# EAGLE design untitled (EAGLE 5.08)
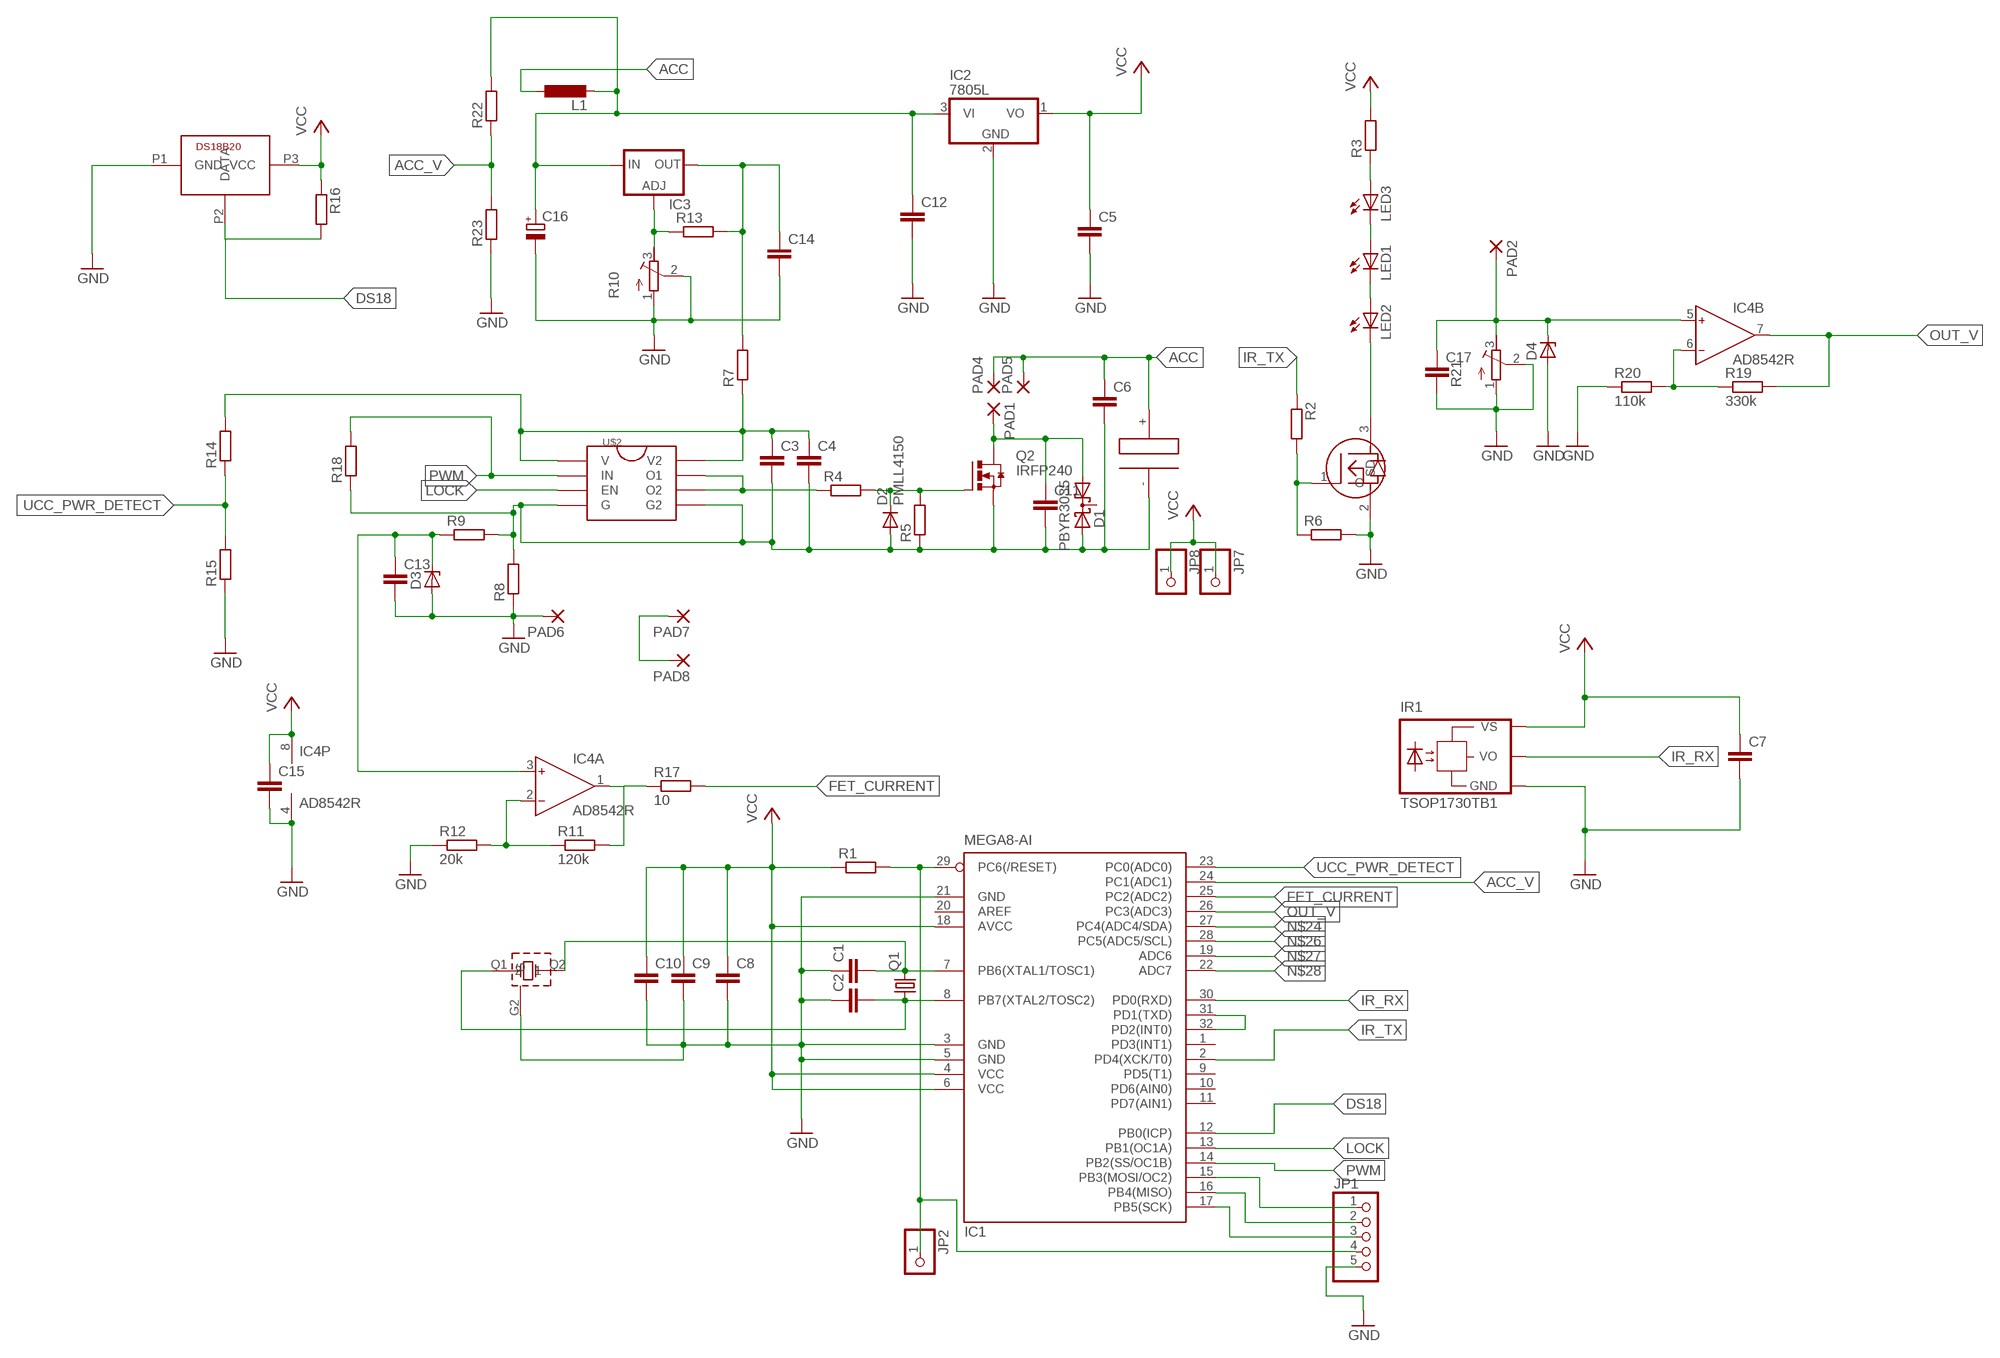
[diagram p0: schematic, sheet 1]

## Parts
C1  C-EUC0805  [C0805]
C2  C-EUC0805  [C0805]
C3  C-EUC1206  [C1206]
C4  C-EU075-032X103  [C075-032X103]
C5  C-EUC1206  [C1206]
C6  C22/10  [C22.5B10]
C7  C-EUC0805  [C0805]
C8  C-EUC0805  [C0805]
C9  C-EUC0805  [C0805]
C10  C-EUC0805  [C0805]
C11  C7.5/6  [C7.5B6]
C12  C-EUC1206  [C1206]
C13  C-EUC1206  [C1206]
C14  C-EUC1206  [C1206]
C15  C-EUC1206  [C1206]
C16  CPOL-EUE7.5-16  [E7,5-16]
C17  C-EUC0805  [C0805]
D1  PBYR3035  [SOT93S]
D2  PMLL4150  [SOD80C]
D3  ZENER-DIODEDO34-7  [DO34Z7]
D4  ZENER-DIODEDO34-7  [DO34Z7]
IC1  MEGA8-AI  [TQFP32-08]
IC2  7805L  [TO92]
IC3  LM317TS  [317TS]
IC4  AD8542R  [SO8]
IR1  TSOP1730TB1  [TSOP17_TB1]
JP1  PINHD-1X5  [1X05]
JP2  PINHD-1X1  [1X01]
JP7  PINHD-1X1  [1X01]
JP8  PINHD-1X1  [1X01]
L1  L-EUL2825P  [L2825P]
LED1  LED5MM  [LED5MM]
LED2  LED5MM  [LED5MM]
LED3  LED5MM  [LED5MM]
PAD1  3,81/1,3  [3,81/1,3]
PAD2  3,81/1,3  [3,81/1,3]
PAD4  3,81/1,3  [3,81/1,3]
PAD5  3,81/1,3  [3,81/1,3]
PAD6  WIREPAD4,16O1,6  [4,16O1,6]
PAD7  WIREPAD4,16O1,6  [4,16O1,6]
PAD8  WIREPAD4,16O1,6  [4,16O1,6]
Q1  CRYSTALHC49S  [HC49/S]
Q2  IRFP240  [TO247BV]
R1  R-EU_M0805  [M0805]
R2  R-EU_M0805  [M0805]
R3  R-EU_M0805  [M0805]
R4  R-EU_M1206  [M1206]
R5  R-EU_M1206  [M1206]
R6  R-EU_M0805  [M0805]
R7  R-EU_0207/12  [0207/12]
R8  R-EU_0309/12  [0309/12]
R9  R-EU_M1206  [M1206]
R10  R-TRIMM3296W  [RTRIM3296W]
R11  120k  R-EU_M1206  [M1206]
R12  20k  R-EU_M1206  [M1206]
R13  R-EU_M0805  [M0805]
R14  R-EU_M1206  [M1206]
R15  R-EU_M1206  [M1206]
R16  R-EU_M1206  [M1206]
R17  10  R-EU_M1206  [M1206]
R18  R-EU_M1206  [M1206]
R19  330k  R-EU_M1206  [M1206]
R20  110k  R-EU_M1206  [M1206]
R21  R-TRIMM3296P  [RTRIM3296P]
R22  R-EU_M1206  [M1206]
R23  R-EU_M1206  [M1206]
U$1  IRLML2803  [MICRO3]
U$2  UCC37322  [SO08]
U$3  KX-7  [KX-7]
U$4  CAP36MM13,6MM  [CAP36MM13.5MM]
U$5  DS18B20  [TO-92]

## Nets
ACC: C6.1 L1.1 PAD4.1(P) PAD5.1(P) U$4.+
ACC_L: C12.1 C16.+ IC2.3(VI) IC3.3(IN) L1.2 R22.2
ACC_V: IC1.24(PC1(ADC1)) R22.1 R23.2
DS18: IC1.12(PB0(ICP)) R16.2 U$5.P2(DATA)
FET_CURRENT: IC1.25(PC2(ADC2)) R17.2
FET_CURRENT0: IC4.1(A:OUT) R11.2 R17.1
GND: C1.1 C2.1 C5.2 C7.2 C8.2 C9.2 C10.2 C12.2 C13.2 C14.2 C15.2 C16.- C17.2 D3.A D4.A IC1.3(GND) IC1.5(GND) IC1.21(GND) IC2.2(GND) IC4.4(P:V-) IR1.GND JP1.5 PAD6.1(P) R6.2 R8.1 R10.1(E) R10.2(S) R12.1 R15.1 R20.1 R21.1(E) R21.2(S) R23.1 U$1.2(S) U$3.G2(G) U$5.P1(GND)
IR_RX: IC1.30(PD0(RXD)) IR1.VO
IR_TX: IC1.2(PD4(XCK/T0)) R2.1
LOCK: IC1.13(PB1(OC1A)) U$2.3(EN)
N$1: IC1.29(PC6(/RESET)) JP1.4 JP2.1 R1.2
N$2: IC1.17(PB5(SCK)) JP1.3
N$3: IC1.16(PB4(MISO)) JP1.2
N$4: IC1.15(PB3(MOSI/OC2)) JP1.1
N$5: C3.1 C4.1 R7.1 R14.2 U$2.1(V) U$2.8(V2)
N$6: C2.2 IC1.8(PB7(XTAL2/TOSC2)) Q1.1 U$3.Q1
N$7: C11.1 D1.A1 PAD1.1(P) Q2.D
N$8: R4.1 U$2.6(O2) U$2.7(O1)
N$9: R2.2 R6.1 U$1.1(G)
N$10: LED2.K(C) U$1.3(D)
N$11: C13.1 D3.C IC4.3(A:IN+) R9.1
N$12: C3.2 C4.2 C6.2 C11.2 D1.A2 D2.A Q2.S R5.1 R8.2 R9.2 R18.1 U$2.4(G) U$2.5(G2) U$4.-
N$13: LED1.A LED3.K(C)
N$14: IC1.31(PD1(TXD)) IC1.32(PD2(INT0))
N$15: D2.C Q2.G R4.2 R5.2
N$16: LED3.A R3.1
N$17: LED1.K(C) LED2.A
N$18: PAD7.1(P) PAD8.1(P)
N$19: C14.1 IC3.2(OUT) R7.2 R13.2
N$21: IC3.1(ADJ) R10.3(A) R13.1
N$22: IC4.2(A:IN-) R11.1 R12.2
N$23: IC4.6(B:IN-) R19.1 R20.2
N$24: IC1.27(PC4(ADC4/SDA))
N$25: C17.1 D4.C IC4.5(B:IN+) PAD2.1(P) R21.3(A)
N$26: IC1.28(PC5(ADC5/SCL))
N$27: IC1.19(ADC6)
N$28: IC1.22(ADC7)
N$29: C1.2 IC1.7(PB6(XTAL1/TOSC1)) Q1.2 U$3.Q2
OUT_V: IC1.26(PC3(ADC3)) IC4.7(B:OUT) R19.2
PWM: IC1.14(PB2(SS/OC1B)) R18.2 U$2.2(IN)
UCC_PWR_DETECT: IC1.23(PC0(ADC0)) R14.1 R15.2
VCC: C5.1 C7.1 C8.1 C9.1 C10.1 C15.1 IC1.4(VCC) IC1.6(VCC) IC1.18(AVCC) IC2.1(VO) IC4.8(P:V+) IR1.VS JP7.1 JP8.1 R1.1 R3.2 R16.1 U$5.P3(VCC)
Unconnected: D1.C IC1.1(PD3(INT1)) IC1.9(PD5(T1)) IC1.10(PD6(AIN0)) IC1.11(PD7(AIN1)) IC1.20(AREF)

## Library data of the parts
C1-C5 C7-C10 C12-C15 C17 = rcl:C-EU: CAPACITOR, European symbol
C6 C11 = capacitor-wima:C: CAPACITOR naming: grid - package width
C16 = rcl:CPOL-EU: POLARIZED CAPACITOR, European symbol
D1 = diode:PBYR3035: Dual DIODE common cathode
D2 = diode:PMLL4150: DIODE high speed
D3 D4 = diode:ZENER-DIODE: Z-Diode
IC1 = atmel:MEGA8: MICROCONTROLLER 8 Kbytes FLASH, 1 kbytes SRAM, 512 bytes EEPROM, USART, 6-channel 10 bit ADC, 2-channel 8 bit ADC Pin compatible with Atmega48, ATMega88, ATMega168 Source: avr.lbr
IC2 = linear:78*: Positive VOLTAGE REGULATOR Source: http://cache.national.com/ds/LM/LM78L05.pdf http://www.fairchildsemi.com/ds/LM/LM7805.pdf
IC3 = v-reg:LM317TS: VOLTAGE REGULATOR
IC4 = analog-devices:AD8542: General-Purpose CMOS Rail-to-Rail Amplifiers Source: http://www.analog.com/static/imported-files/data_sheets/AD8541_8542_8544.pdf
IR1 = telefunken:TSOP17*TB1: TSOP17..TB1 IR Receiver Modules for Remote Control Systems Source: http://www.vishay.com/docs/82042/82042.pdf
JP1 = pinhead:PINHD-1X5: PIN HEADER
JP2 JP7 JP8 = pinhead:PINHD-1X1: PIN HEADER
L1 = rcl:L-EU: INDUCTOR, European symbol
LED1-LED3 = led:LED: LED OSRAM: - CHIPLED LG R971, LG N971, LY N971, LG Q971, LY Q971, LO R971, LY R971 LH N974, LH R974 LS Q976, LO Q976, LY Q976 LO Q996 - Hyper CHIPLED LW Q18S LB Q993, LB Q99A, LB R99A - SideLED LS A670, LO A670, LY A670, LG A670, LP A670 LB A673, LV A673, LT A673, LW A673 LH A674 LY A675 LS A676, LA A676, LO A676, LY A676, LW A676 LS A679, LY A679, LG A679 - Hyper Micro SIDELED® LS Y876, LA Y876, LO Y876, LY Y876 LT Y87S - SmartLED LW L88C, LW L88S LB L89C, LB L89S, LG L890 LS L89K, LO L89K, LY L89K LS L896, LA L896, LO L896, LY L896 - TOPLED LS T670, LO T670, LY T670, LG T670, LP T670 LSG T670, LSP T670, LSY T670, LOP T670, LYG T670 LG T671, LOG T671, LSG T671 LB T673, LV T673, LT T673, LW T673 LH T674 LS T676, LA T676, LO T676, LY T676, LB T676, LH T676, LSB T676, LW T676 LB T67C, LV T67C, LT T67C, LS T67K, LO T67K, LY T67K, LW E67C LS E67B, LA E67B, LO E67B, LY E67B, LB E67C, LV E67C, LT E67C LW T67C LS T679, LY T679, LG T679 LS T770, LO T770, LY T770, LG T770, LP T770 LB T773, LV T773, LT T773, LW T773 LH T774 LS E675, LA E675, LY E675, LS T675 LS T776, LA T776, LO T776, LY T776, LB T776 LHGB T686 LT T68C, LB T68C - Hyper Mini TOPLED® LB M676 - Mini TOPLED Santana® LG M470 LS M47K, LO M47K, LY M47K Source: http://www.osram.convergy.de LUXEON: - LUMILED® LXK2-PW12-R00, LXK2-PW12-S00, LXK2-PW14-U00, LXK2-PW14-V00 LXK2-PM12-R00, LXK2-PM12-S00, LXK2-PM14-U00 LXK2-PE12-Q00, LXK2-PE12-R00, LXK2-PE12-S00, LXK2-PE14-T00, LXK2-PE14-U00 LXK2-PB12-K00, LXK2-PB12-L00, LXK2-PB12-M00, LXK2-PB14-N00, LXK2-PB14-P00, LXK2-PB14-Q00 LXK2-PR12-L00, LXK2-PR12-M00, LXK2-PR14-Q00, LXK2-PR14-R00 LXK2-PD12-Q00, LXK2-PD12-R00, LXK2-PD12-S00 LXK2-PH12-R00, LXK2-PH12-S00 LXK2-PL12-P00, LXK2-PL12-Q00, LXK2-PL12-R00 Source: www.luxeon.com KINGBRIGHT: KA-3528ASYC Source: www.kingbright.com
PAD1 PAD2 PAD4 PAD5 = wirepad:3,81/1,3: THROUGH-HOLE PAD
PAD6-PAD8 = wirepad:WIREPAD: Wire PAD connect wire on PCB
Q1 = crystal:CRYSTAL: CRYSTAL
Q2 = transistor-power:IRFP240: HEXFET Power MosFet Source: http://www.irf.com/
R1-R9 R11-R20 R22 R23 = resistor:R-EU_: RESISTOR, European symbol
R10 R21 = rcl:R-TRIMM: Trimm resistor
U$1 = transistor-power:IRLML2803
U$2 = stabil:UCC37322
U$3 = ARM:KX-7
U$4 = stabil:CAP36MM13,6MM
U$5 = DETECTORS:DS18B20

## Board
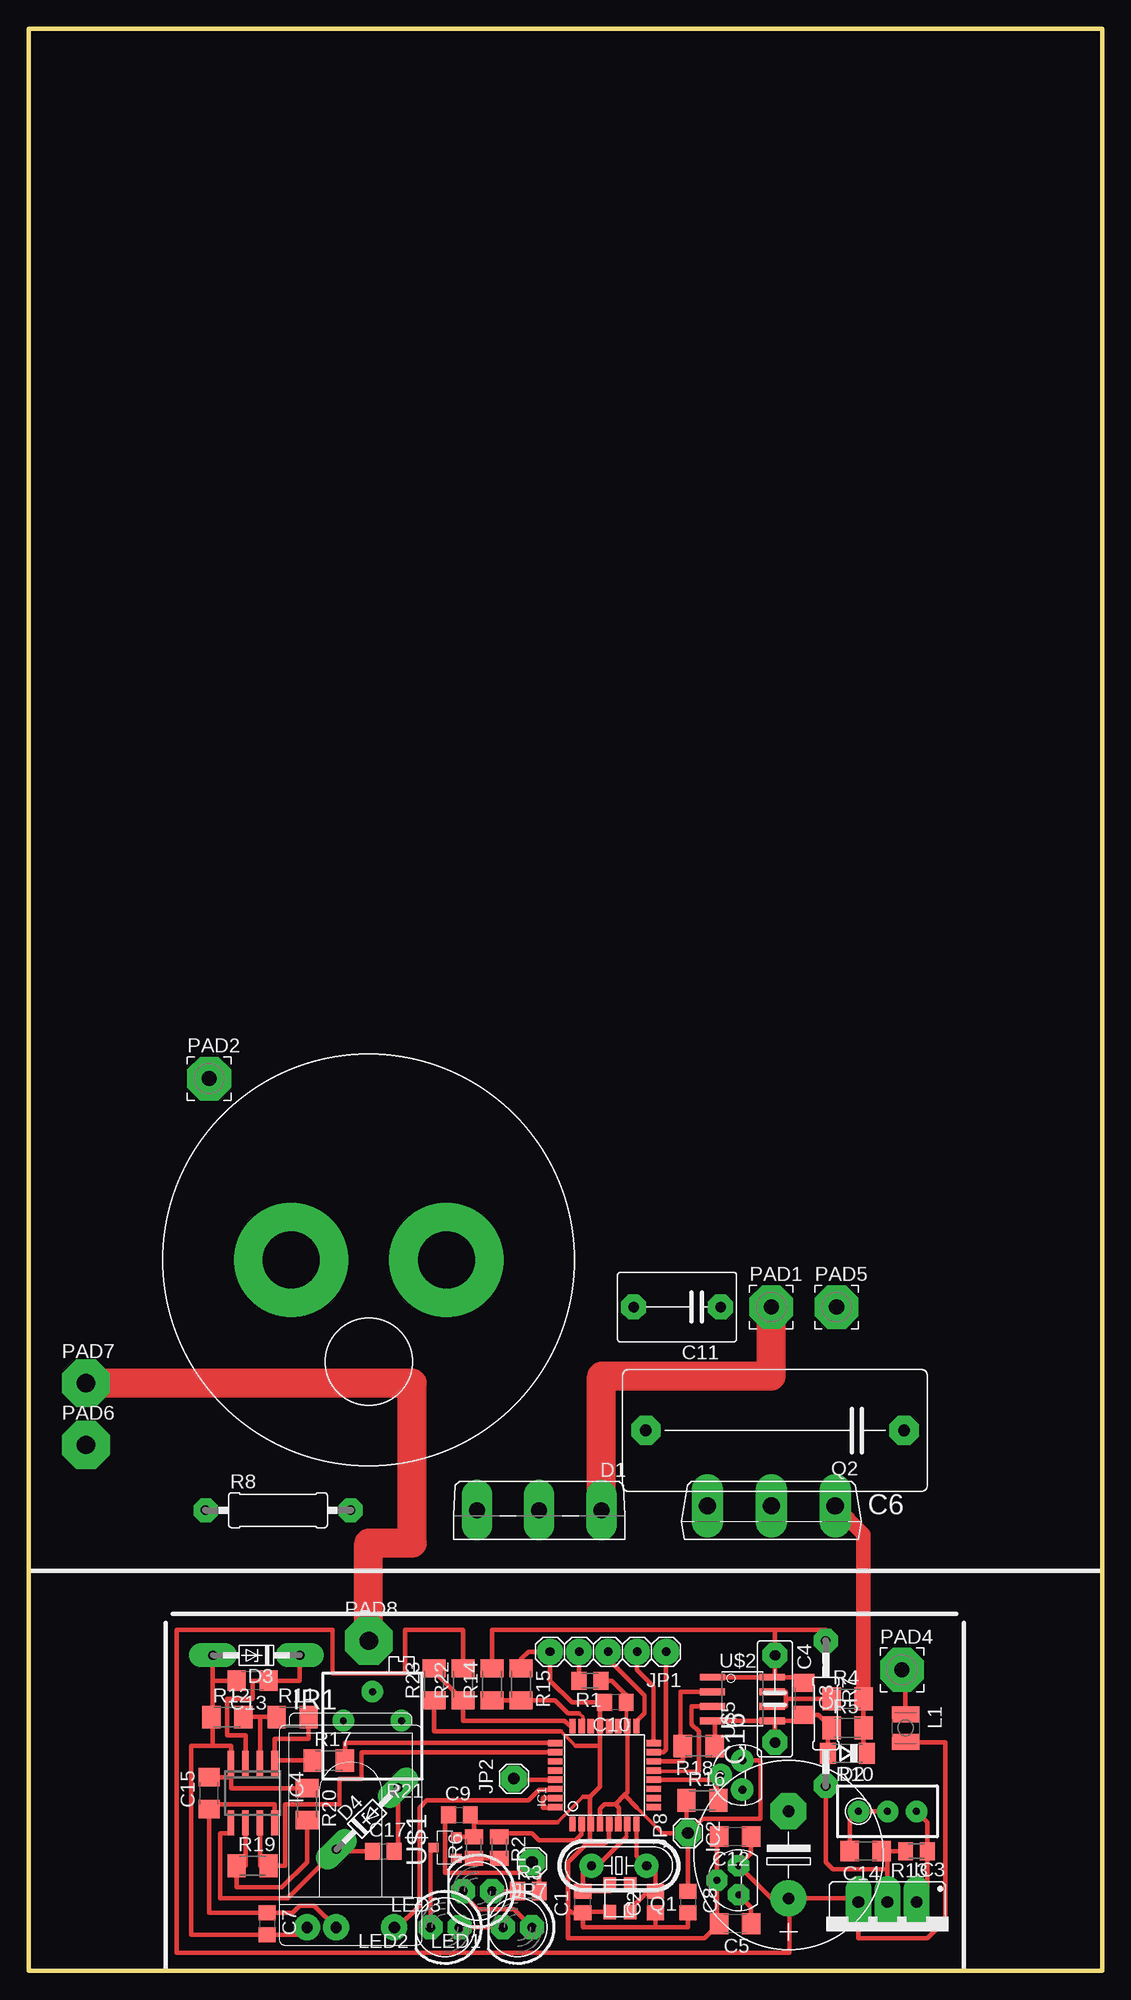
[diagram p1: board, top side]
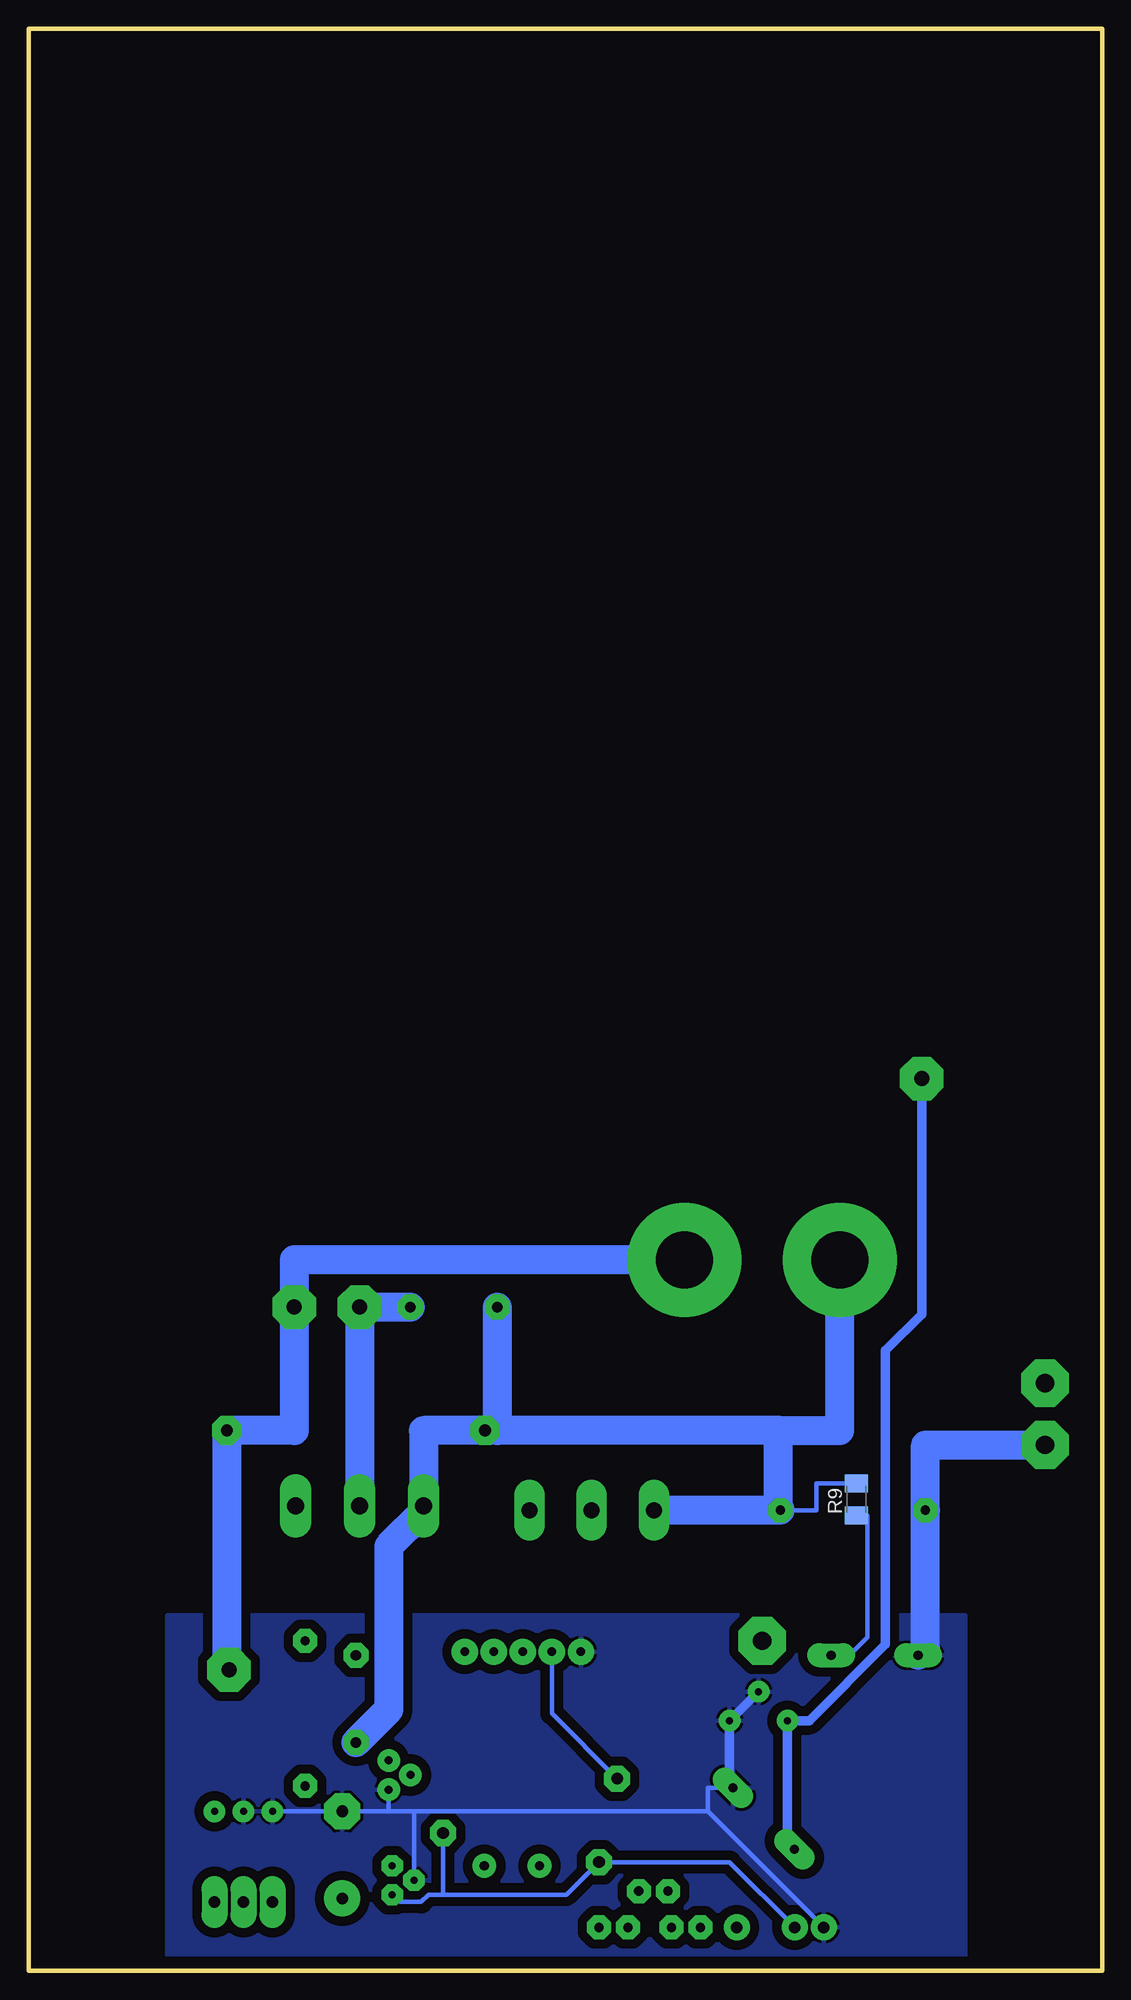
[diagram p2: board, bottom side, seen from below]

Size 94 x 170 mm. Coordinates in mm from the lower left corner, seen from the top.
Outline: 0,0 94,0 94,170 0,170 0,0
Copper layers (1*16): Top 0.035mm / dielectric 1.5mm / Bottom 0.035mm
Design rules "default *": minimum track width 0.2mm, minimum drill 0.2mm, track to track 0.24mm, track to pad 0.24mm, pad to pad 0.2mm, via to via 0.2mm, smd to smd 0.2mm, copper to edge 40mil, drill to drill 40mil, minimum pad ring 25mil, minimum via ring 12mil, stop-mask expansion 4mil, vias tented up to drill 0mil, thermal gap 10mil

### Footprints (pad centres in the part's own frame; a part is rotated, then mirrored left to right if it is on the bottom)
C0805 = smd 1.3 x 1.5: 1 -0.95,0; 2 0.95,0
C1206 = smd 1.6 x 1.8: 1 -1.4,0; 2 1.4,0
C075-032X103 = drill 0.914 octagon: 1 -3.81,0; 2 3.81,0
C22.5B10 = drill 1.016 pad 2.54 octagon: 1 -11.303,0; 2 11.303,0
C7.5B6 = drill 0.914 pad 1.905 octagon: 1 -3.81,0; 2 3.81,0
E7,5-16 = drill 1.016 pad 3.15 round: + -3.81,0 | drill 1.016 pad 3.15 octagon: - 3.81,0
SOT93S = drill 1.397 long: A1 -5.461,-2.54; A2 5.461,-2.54; C 0,-2.54
SOD80C = smd 1.4 x 1.8: A 1.7,0; C -1.7,0
DO34Z7 = drill 0.813 long: A 3.81,0; C -3.81,0
TQFP32-08 = smd 1.27 x 0.559: 1 -4.293,2.8; 2 -4.293,2; 3 -4.293,1.2; 4 -4.293,0.4; 5 -4.293,-0.4; 6 -4.293,-1.2; 7 -4.293,-2; 8 -4.293,-2.8; 17 4.293,-2.8; 18 4.293,-2; 19 4.293,-1.2; 20 4.293,-0.4; 21 4.293,0.4; 22 4.293,1.2; 23 4.293,2; 24 4.293,2.8 | smd 0.559 x 1.27: 9 -2.8,-4.293; 10 -2,-4.293; 11 -1.2,-4.293; 12 -0.4,-4.293; 13 0.4,-4.293; 14 1.2,-4.293; 15 2,-4.293; 16 2.8,-4.293; 25 2.8,4.293; 26 2,4.293; 27 1.2,4.293; 28 0.4,4.293; 29 -0.4,4.293; 30 -1.2,4.293; 31 -2,4.293; 32 -2.8,4.293
TO92 = drill 0.6 pad 1.676 octagon: 1 -1.27,0; 2 0,1.905; 3 1.27,0
317TS = drill 1.016 long: 1 -2.54,-2.54; 2 0,-2.54; 3 2.54,-2.54
SO8 = smd 0.6 x 2.2: 1 -1.905,-2.6; 2 -0.635,-2.6; 3 0.635,-2.6; 4 1.905,-2.6; 5 1.905,2.6; 6 0.635,2.6; 7 -0.635,2.6; 8 -1.905,2.6
TSOP17_TB1 = drill 1 pad 1.676 round: GND 0,-3.81; VO 0,3.81; VS 0,-1.27
1X05 = drill 0.762 pad 2.286 round: 1 -5.08,0; 2 -2.54,0; 3 0,0; 4 2.54,0; 5 5.08,0
1X01 = drill 1.016 octagon: 1 0,0
L2825P = smd 1.4 x 2.4: 1 -1.2,0; 2 1.2,0
LED5MM = drill 0.813 octagon: A -1.27,0; K 1.27,0
3,81/1,3 = drill 1.321 pad 3.81 octagon: 1 0,0
4,16O1,6 = drill 1.6 pad 4.166 octagon: 1 0,0
HC49/S = drill 0.813 round: 1 -2.413,0; 2 2.413,0
TO247BV = drill 1.499 long: D 0,-2.921; G -5.588,-2.921; S 5.588,-2.921
M0805 = smd 1.3 x 1.6: 1 -0.95,0; 2 0.95,0
M1206 = smd 1.6 x 2: 1 -1.4,0; 2 1.4,0
0207/12 = drill 0.813 octagon: 1 -6.35,0; 2 6.35,0
0309/12 = drill 0.813 octagon: 1 -6.35,0; 2 6.35,0
RTRIM3296W = drill 0.61 round: 1 0,-2.54; 2 0,0; 3 0,2.54
RTRIM3296P = drill 0.61 round: 1 0,-2.54; 2 2.54,0; 3 0,2.54
MICRO3 = smd 0.8 x 0.9: 1 -0.95,-1; 2 0.95,-1; 3 0,1
SO08 = smd 0.61 x 2.21: 1 -1.905,-2.616; 2 -0.635,-2.616; 3 0.635,-2.616; 4 1.905,-2.616; 5 1.905,2.616; 6 0.635,2.616; 7 -0.635,2.616; 8 -1.905,2.616
KX-7 = smd 1.3 x 1.1: G1 2.8,0.3; G2 0.4,2.1; Q1 0.4,0.3; Q2 2.8,2.1
CAP36MM13.5MM = drill 5 pad 10 round: + -6.8,0; - 6.8,0
TO-92 = drill 0.7 round: P1 -1.27,0; P2 0,1.905; P3 1.27,0

### Placement (x,y rotation side)
C1  48.51,6.03 90 top
C2  54.86,6.03 90 top
C3  67.88,23.81 270 top
C4  65.34,23.81 270 top
C5  61.85,4.13 180 top
C6  65.34,47.31 180 top
C7  20.89,4.13 270 top
C8  57.72,6.03 270 top
C9  37.72,13.65 0 top
C10  51.37,23.5 180 top
C11  56.77,58.1 180 top
C12  61.85,11.75 180 top
C13  19.62,25.4 180 top
C14  73.28,10.48 180 top
C15  15.81,15.56 90 top
C16  66.53,10.16 90 top
C17  31.05,10.48 0 top
D1  44.7,37.78 180 top
D2  71.69,19.05 180 top
D3  19.94,27.62 180 top
D4  29.65,13.34 45 top
IC1  50.42,17.14 90 top
IC2  62.16,7.94 90 top
IC3  75.18,3.49 180 top
IC4  19.62,15.56 180 top
IR1  28.19,3.81 270 top
JP1  50.73,27.94 180 top
JP2  42.48,16.83 90 top
JP7  44.07,9.53 180 top
JP8  57.72,12.06 90 top
L1  76.77,21.27 270 top
LED1  42.8,3.81 180 top
LED2  36.45,3.81 180 top
LED3  39.3,6.99 180 top
PAD1  65.02,58.1 0 top
PAD2  15.81,78.11 0 top
PAD4  76.45,26.35 0 top
PAD5  70.74,58.1 0 top
PAD6  5.01,46.04 0 top
PAD7  5.01,51.44 0 top
PAD8  29.78,28.89 0 top
Q1  51.69,9.21 180 top
Q2  65.02,37.78 180 top
R1  49.15,25.4 180 top
R2  41.21,10.79 270 top
R3  43.75,6.99 0 top
R4  71.69,23.81 0 top
R5  71.69,21.27 0 top
R6  38.99,10.79 90 top
R7  69.78,22.54 270 top
R8  21.84,40.32 0 top
R9  21.52,41.27 90 bottom
R10  75.18,13.97 270 top
R11  23.11,22.23 0 top
R12  17.4,22.23 0 top
R13  77.72,10.48 180 top
R14  40.58,25.08 90 top
R15  43.11,25.08 270 top
R16  58.99,14.92 0 top
R17  26.29,18.41 0 top
R18  58.67,19.68 180 top
R19  19.62,9.21 0 top
R20  24.38,14.61 270 top
R21  30.1,21.91 90 top
R22  38.03,25.08 90 top
R23  35.5,25.08 90 top
U$1  36.45,10.79 90 top
U$2  62.48,23.81 270 top
U$3  52.96,4.76 90 top
U$4  29.78,62.23 180 top
U$5  62.48,17.14 90 top

### Tracks (layer width: path | path; a pad name or v marks a point on that pad's centre or on a via)
ACC
  Top 0.406: L1.1 76.77,26.04 PAD4.1
  Bottom 2.54: U$4.+ 70.74,62.23 PAD5.1 70.74,47.31 C6.1 76.64,26.54 PAD4.1
ACC_L
  Top 0.406: L1.2 76.84,20 80.26,20 80.26,4.45 78.67,2.86 72.64,2.86 IC3.3 72.33,6.35 C16.+ | 63.44,11.75 63.44,11.94 C12.1 63.25,10.29 IC2.3 65.02,6.35 C16.+ | R22.2 38.03,29.84 32.95,29.84 32.95,26.04 26.61,26.04 26.61,29.84 12.95,29.84 12.95,1.59 66.61,1.59 66.61,6.27 C16.+
ACC_V
  Top 0.406: R23.2 35.5,26.22 R22.1 38.03,21.91 46.92,21.91 47.4,21.44 IC1.24
DS18
  Top 0.406: IC1.12 60.26,16.75 | 60.26,16.75 60.58,16.75 U$5.P2 | R16.2 60.26,14.92 60.26,16.75
FET_CURRENT
  Top 0.406: IC1.25 27.69,19.95 R17.2
FET_CURRENT0
  Top 0.406: R11.2 24.51,20.32 21.52,20.32 IC4.1 21.52,18.41 R17.1
GND
  Top 0.305: 48.51,15.24 46.29,13.02 | 47.88,19.68 46.61,20.95
  Top 0.406: C1.1 48.51,3.81 54.86,3.81 | 54.86,3.81 C2.1 | U$3.G2 48.59,5.16 C1.1 | IC1.5 50.82,11.51 50.42,11.11 49.47,11.11 | 49.47,11.11 49.15,11.43 49.15,12.78 IC1.3 49.15,12.92 49.15,15.24 | 49.47,11.11 48.83,11.11 47.24,9.53 47.24,5.4 | U$1.2 R6.2 38.99,13.02 | 47.24,5.4 47.56,5.08 C1.1 | 50.02,19.68 50.02,16.11 49.15,15.24 | 50.02,19.68 IC1.21 50.02,23.09 C10.2 47.56,23.5 45.66,25.4 JP1.5 43.75,27.94 43.11,27.3 R15.1 | 49.15,15.24 48.51,15.24 | C8.2 57.72,3.81 54.86,3.81 | 47.24,5.4 47.24,2.86 59.18,2.86 C5.2 60.26,4.32 IC2.2 60.26,11.56 C12.2 | R10.2 R10.1 71.88,13.21 C14.2 | C15.2 17.71,16.96 IC4.4 | IC4.4 17.71,19.68 16.13,19.68 | 16.13,22.23 R12.1 | 16.13,22.23 16.13,25.4 | 16.13,25.4 D3.A | 16.13,25.4 C13.2 | 16.13,19.68 14.22,19.68 14.22,3.17 C7.2 24.38,3.18 IR1.GND | 38.99,13.02 38.99,13.33 C9.2 | 16.13,19.68 16.13,22.23 | 46.29,13.02 38.99,13.02 | R20.1 17.71,16 IC4.4 | C17.2 32.34,10.48 D4.A | R23.1 35.5,20.95 46.61,20.95 | 50.02,19.68 47.88,19.68
  Bottom 0.406: 60.26,13.97 IC2.2 | IR1.GND 34.54,13.97 | 34.54,13.97 60.26,13.97 | 60.26,13.97 62.48,13.97 | 62.48,13.97 C16.- R10.1 | 62.48,13.97 U$5.P1 | 34.54,13.97 34.54,16.03 D4.A 32.64,16.32
  Bottom 0.813: R21.2 R21.1 32.64,16.32
  Bottom 2.54: D3.A 15.49,28.26 R8.1 15.49,46.04 PAD6.1
  pour Bottom (isolate 0.813): 12,0 12,31.11 81.85,31.11 81.85,0
IR_RX
  Top 0.406: IC1.30 46.05,15.88 44.7,15.88 43.75,14.92 34.86,14.92 34.23,14.29 34.23,5.71 32.32,3.81 IR1.VO
IR_TX
  Top 0.406: IC1.2 48.42,11.97 47.88,11.43 44.7,11.43 44.07,12.06 41.53,12.06 R2.1
LOCK
  Top 0.305: 58.67,17.46 54.79,17.46 IC1.13
  Top 0.406: U$2.3 58.04,23.18 58.04,21.59 58.67,20.95 58.67,17.46
N$1
  Top 0.406: IC1.29 42.48,16.75 JP2.1 | R1.2 JP1.4
  Bottom 0.406: JP2.1 48.2,22.54 JP1.4
N$2
  Top 0.406: IC1.17 53.22,21.85 53.91,22.54 53.91,24.13 50.73,27.3 JP1.3
N$3
  Top 0.406: IC1.16 54.71,24.92 53.27,26.35 JP1.2
N$4
  Top 0.406: IC1.15 55.59,19.14 55.81,19.37 JP1.1
N$5
  Top 0.406: U$2.1 U$2.8 65.34,25.72 | 65.34,25.72 C4.1 65.34,29.84 | 68.2,25.53 C3.1 67.38,25.72 65.34,25.72 | R14.2 40.58,29.84 65.34,29.84 | 65.34,29.84 69.78,29.84 R7.1
N$6
  Top 0.406: IC1.8 53.22,10.09 Q1.1 54.86,9.21 C2.2 54.23,6.99 52.66,5.42 U$3.Q1
N$7
  Top 2.54: D1.A1 50.16,52.07 65.02,52.07 PAD1.1
  Bottom 2.54: Q2.D PAD1.1 C11.1
N$8
  Top 0.406: U$2.7 66.29,24.45 66.29,23.81 | 66.29,23.81 66.29,23.18 U$2.6 | 66.29,23.81 R4.1
N$9
  Top 0.406: U$1.1 R6.1 R2.2
N$10
  Top 0.406: LED2.K 35.18,10.53 U$1.3
N$11
  Top 0.406: D3.C 23.75,25.4 C13.1 19.62,25.4 19.62,23.81 17.4,23.81 17.4,20.64 18.98,20.64 IC4.3
  Bottom 0.406: R9.1 20.57,39.88 20.57,29.21 22.16,27.62 D3.C
N$12
  Top 0.406: C4.2 65.34,21.91 | 65.34,21.91 U$2.5 U$2.4 60.07,21.91 R18.1 | 65.34,21.91 67.38,21.91 C3.2 69.15,22.41 R5.1 69.99,20.97 D2.A
  Bottom 0.406: R9.2 25.02,42.67 25.02,40.32 R8.2
  Bottom 2.54: 52.96,47.31 C6.2 59.43,47.31 Q2.S 59.43,40.2 62.48,37.15 62.48,22.86 C4.2 | 52.96,47.31 C11.2 | 28.35,47.31 52.96,47.31 | D1.A2 R8.2 28.35,40.48 28.35,47.31 | 28.35,47.31 28.38,47.34 | 28.35,47.31 22.98,47.31 U$4.-
N$13
  Top 0.406: LED3.K 38.03,6.67 39.3,5.4 42.48,5.4 LED1.A
N$14
  Top 0.406: IC1.31 45.02,15.14 45.02,14.29 46.12,14.29 IC1.32
N$15
  Top 0.406: R4.2 R5.2 73.09,19.35 D2.C
  Top 1.27: R4.2 73.09,38.22 Q2.G
N$16
  Top 0.406: LED3.A R3.1
N$17
  Top 0.406: LED2.A LED1.K
N$18
  Top 2.54: PAD7.1 33.59,51.44 33.59,37.47 29.78,37.47 PAD8.1
N$19
  Top 0.406: 75.18,10.48 C14.1 | 75.18,10.48 R13.2 | 75.18,8.89 IC3.2 | 75.18,8.89 75.18,10.48 | 75.18,8.89 70.42,8.89 69.78,9.53 R7.2
N$21
  Top 0.406: R10.3 78.67,13.02 R13.1 78.67,6.98 IC3.1
N$22
  Top 0.406: 20.26,22.23 R12.2 | 20.26,22.23 R11.1 | IC4.2 20.26,22.23
N$23
  Top 0.406: IC4.6 18.98,9.21 R19.1 18.22,7.3 22.16,7.3 24.38,9.53 R20.2
N$25
  Top 0.406: IC4.5 17.71,12.06 16.76,12.06 16.76,6.35 22.66,6.35 D4.C 26.95,10.48 C17.1
  Bottom 0.406: D4.C 27.56,11.24
  Bottom 0.813: 27.56,11.24 R21.3 25.65,21.91 18.98,28.57 18.98,54.29 15.81,57.47 PAD2.1
N$29
  Top 0.305: 52.32,11.75 52.32,12.76 IC1.7
  Top 0.406: U$3.Q2 50.86,6.98 C1.2 48.51,9.21 Q1.2 49.78,9.21 52.32,11.75
OUT_V
  Top 0.406: IC4.7 20.26,9.21 R19.2 22.48,9.21 22.48,14.61 27.24,14.61 27.24,16.83 29.14,16.83 29.14,19.14 IC1.26
PWM
  Top 0.406: 59.8,24.38 U$2.2 57.09,24.45 57.09,19.68 R18.2 57.27,18.34 IC1.14
UCC_PWR_DETECT
  Top 0.305: 48.2,22.54 48.51,22.23 48.51,21.53 IC1.23
  Top 0.406: R14.1 R15.2 46.1,23.68 47.24,22.54 48.2,22.54
VCC
  Top 0.305: IC1.18 52.32,21.54 C10.1 | 55.5,12.06 53.27,14.29
  Top 0.406: IC1.4 50.02,14.21 50.42,14.61 51.37,14.61 | 51.37,14.61 51.69,14.29 51.69,12.92 IC1.6 | IC1.18 52.42,15.65 52.16,15.4 | 52.16,15.4 51.37,14.61 | 53.27,14.29 52.16,15.4 | JP8.1 C8.1 | JP8.1 57.72,11.75 | C5.1 63.25,5.58 IC2.1 | R1.1 51.05,25.4 52.32,24.13 C10.1 | IC4.8 21.52,14.61 15.81,14.61 C15.1 15.81,5.08 C7.1 23.11,5.08 23.75,5.71 25.02,5.71 IR1.VS | R3.2 44.7,8.89 JP7.1 43.11,8.57 36.45,8.57 36.45,13.33 C9.1 | JP8.1 55.5,12.06 | JP8.1 57.59,12.06 R16.1 | U$5.P3 64.07,18.41 64.07,13.34 58.99,13.34 JP8.1
  Bottom 0.406: IR1.VS 32.64,9.53 JP7.1 46.92,6.67 57.72,6.67 | 57.72,6.67 58.99,6.67 59.62,6.03 61.53,6.03 IC2.1 | 57.72,6.67 JP8.1